# EAGLE schematic nbedmbed_minipro (EAGLE 7.1.0)
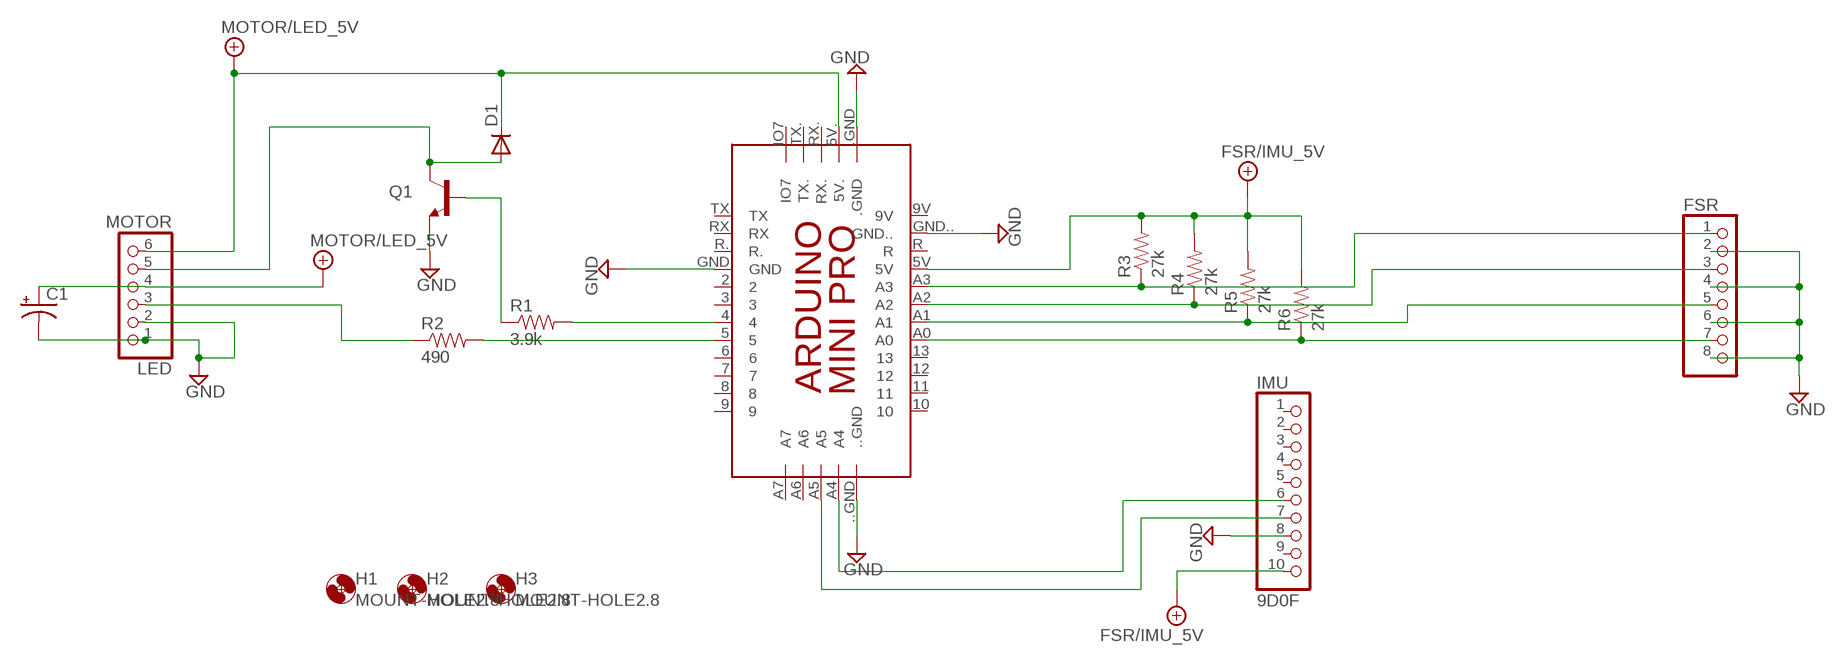
[diagram p0: schematic, sheet 1]

## Parts
C1  CAP_POLPTH1  [CPOL-RADIAL-100UF-25V]
D1  DIODE1N4148  [DIODE-1N4148]
FSR  PINHD-1X8BIG  [1X08-BIG]
H1  MOUNT-HOLE2.8  [2,8]
H2  MOUNT-HOLE2.8  [2,8]
H3  MOUNT-HOLE2.8  [2,8]
IMU  9D0F  PINHD-1X10  [1X10-BIG]
LED  MOTOR  PINHD-1X6B  [1X06-BIG]
PCB2  ARDUINO_MINI_PRO  [ARDUINO_MINI_PRO]
Q1  TRANSISTOR_NPNTO-92-AMMO  [TO-92-AMMO]
R1  3.9k  RESISTORPTH-1/6W  [1/6W-RES]
R2  490  RESISTORPTH-1/6W  [1/6W-RES]
R3  27k  RESISTORPTH-1/6W  [1/6W-RES]
R4  27k  RESISTORPTH-1/6W  [1/6W-RES]
R5  27k  RESISTORPTH-1/6W  [1/6W-RES]
R6  27k  RESISTORPTH-1/6W  [1/6W-RES]

## Nets
FSR/IMU_5V: IMU.10 PCB2.5V R3.2 R4.2 R5.2 R6.2
GND: C1.2(-) FSR.2 FSR.4 FSR.6 FSR.8 IMU.8 LED.1 LED.2 PCB2...GND PCB2..GND PCB2.GND PCB2.GND.. Q1.1(E)
MOTOR/LED_5V: C1.1(+) D1.C LED.4 LED.6 PCB2.5V.
N$1: PCB2.4 R1.2
N$2: PCB2.5 R2.2
N$3: Q1.2(B) R1.1
N$4: LED.3 R2.1
N$5: FSR.1 PCB2.A3 R3.1
N$6: FSR.3 PCB2.A2 R4.1
N$7: D1.A LED.5 Q1.3(C)
N$8: FSR.5 PCB2.A1 R5.1
N$9: FSR.7 PCB2.A0 R6.1
N$10: IMU.6 PCB2.A4
N$11: IMU.7 PCB2.A5
Unconnected: IMU.1 IMU.2 IMU.3 IMU.4 IMU.5 IMU.9 PCB2.2 PCB2.3 PCB2.6 PCB2.7 PCB2.8 PCB2.9 PCB2.9V PCB2.10 PCB2.11 PCB2.12 PCB2.13 PCB2.A6 PCB2.A7 PCB2.IO7 PCB2.R PCB2.R. PCB2.RX PCB2.RX. PCB2.TX PCB2.TX.

## Library data of the parts
C1 = SparkFun-Capacitors:CAP_POL: Capacitor Polarized These are standard SMD and PTH capacitors. Normally 10uF, 47uF, and 100uF in electrolytic and tantalum varieties. Always verify the external diameter of the through hole cap, it varies with capacity, voltage, and manufacturer. The EIA devices should be standard.
D1 = SparkFun-DiscreteSemi:DIODE: Diode These are standard reverse protection diodes and small signal diodes. SMA package can handle up to about 1A. SOD-323 can handle about 200mA. What the SOD-323 package when ordering, there are some mfgs out there that are 5-pin packages.
FSR = adafruit:PINHD-1X8: PIN HEADER
H1-H3 = holes:MOUNT-HOLE: MOUNTING HOLE with drill center marker
IMU = adafruit:PINHD-1X10: Pin header 1x10 0.1" spacing With round pins
LED = adafruit:PINHD-1X6: PIN HEADER
PCB2 = IDD:ARDUINO_MINI_PRO: Device for representing an Arduino Mini board with a footprint in an EAGLE design. Created by Dave Young for Element14. More EAGLE documentation at: http://www.element14.com/community/community/knode/cadsoft_eagle
Q1 = SparkFun-DiscreteSemi:TRANSISTOR_NPN: Generic NPN BJT MMBT2222A - TRANS-08049 (SOT-23, 1A 40V) MPSA42 - TRANS-09116 (SOT-23, 500mA 300V) MMBT5088LT1G - TRANS-11160 (SOT-23, 50 mA 30V)
R1-R6 = SparkFun-Resistors:RESISTOR: Resistor Basic schematic elements and footprints for 0603, 1206, and PTH resistors.